# EAGLE design SmartRock_4-pin_EC_Breakout_v5 (EAGLE 9.7.0)
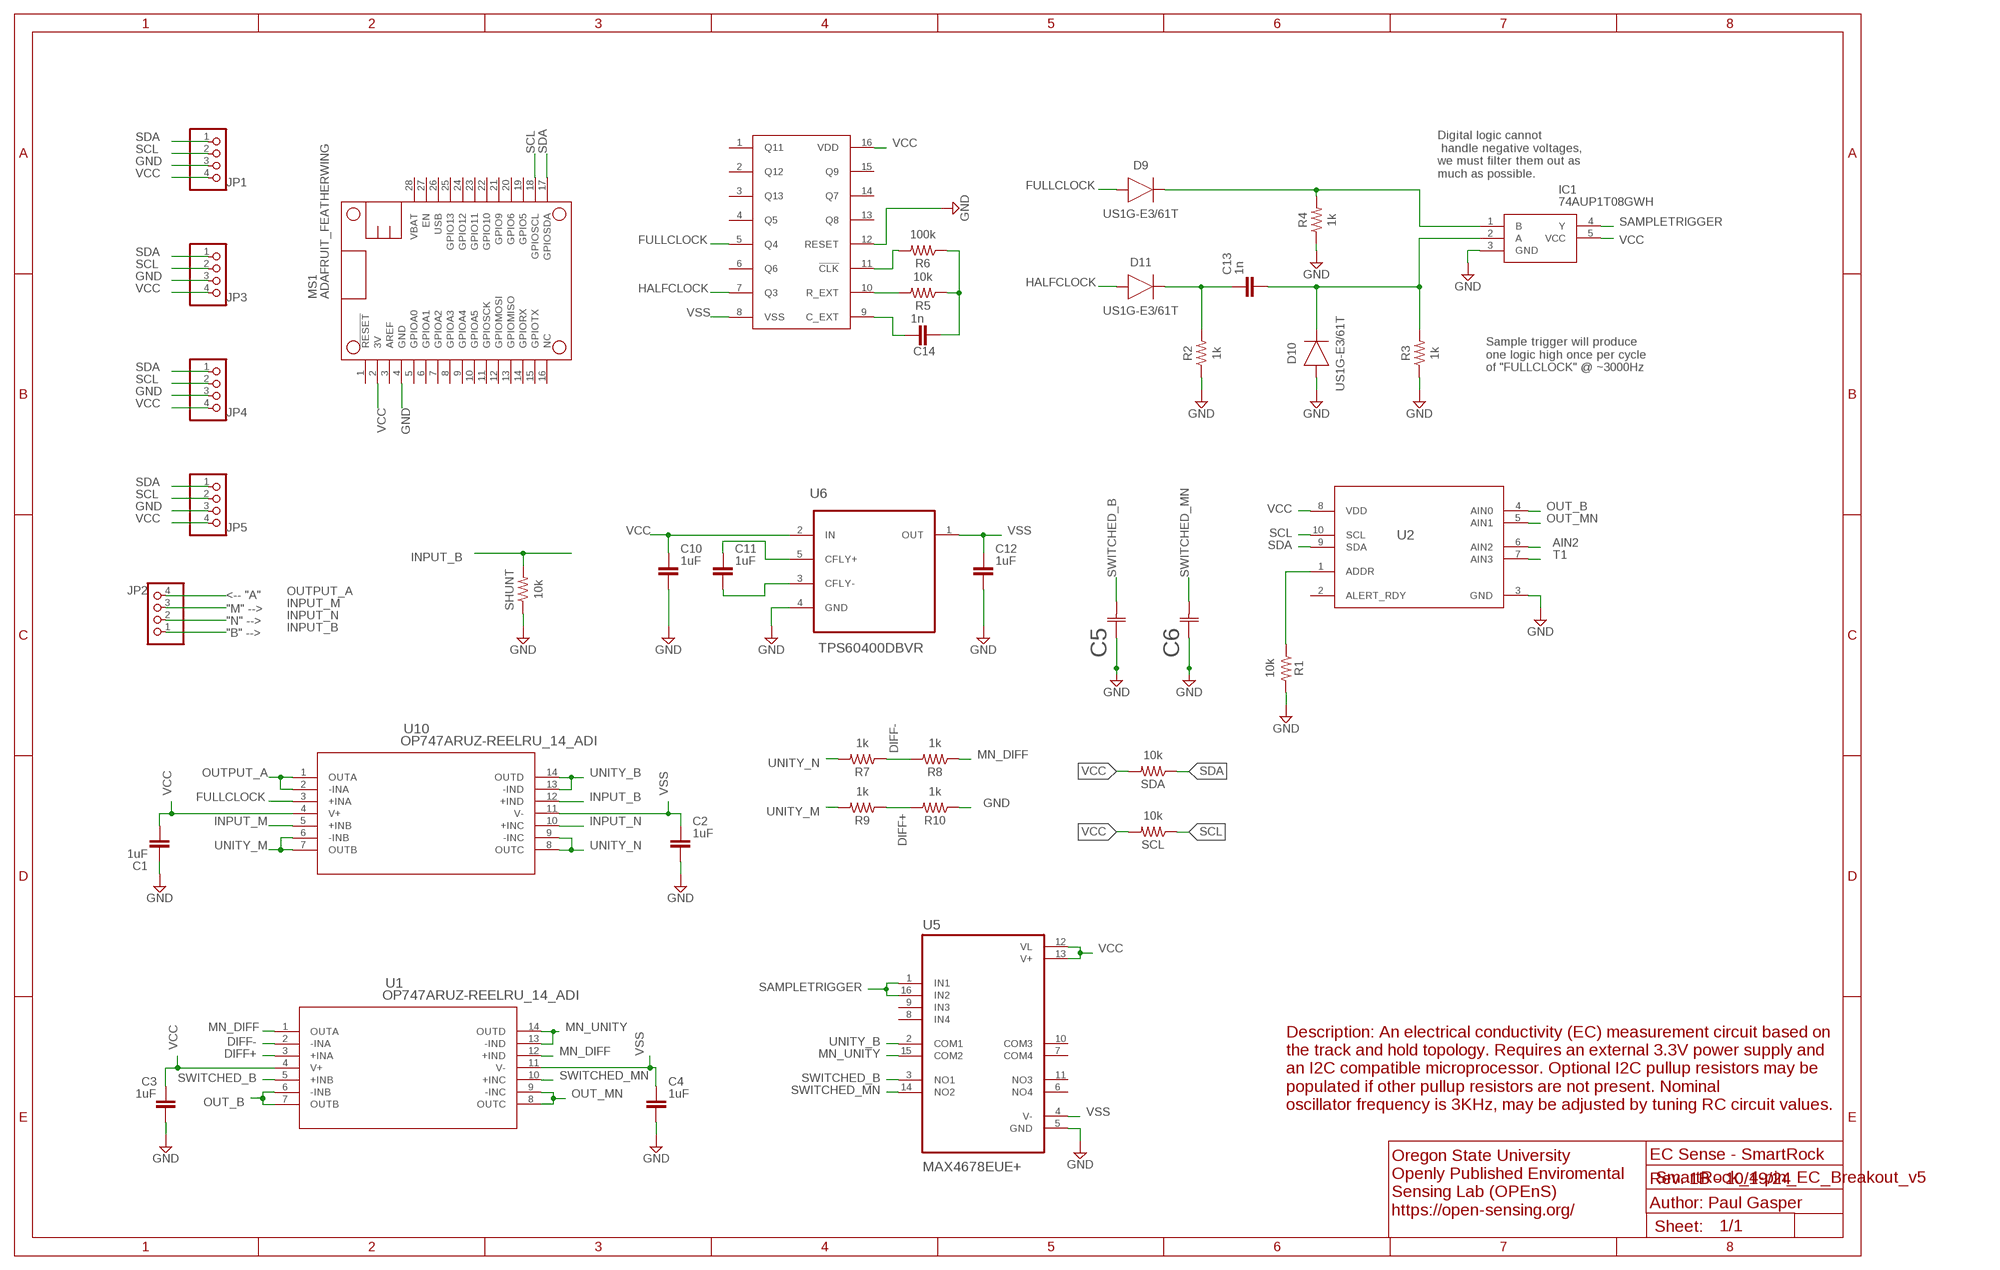
[diagram p0: schematic, sheet 1]

## Parts
C1  1uF  C_CHIP-0402(1005-METRIC)  [CAPC1005X60]
C2  1uF  C_CHIP-0402(1005-METRIC)  [CAPC1005X60]
C3  1uF  C_CHIP-0402(1005-METRIC)  [CAPC1005X60]
C4  1uF  C_CHIP-0402(1005-METRIC)  [CAPC1005X60]
C5  865090640004CAP_WCAP-ASLU_04P0X05P5_WRE-L  [CAP_WCAP-ASLU_04P0X05P5_WRE-L]
C6  865090640004CAP_WCAP-ASLU_04P0X05P5_WRE-L  [CAP_WCAP-ASLU_04P0X05P5_WRE-L]
C10  1uF  C_CHIP-0402(1005-METRIC)  [CAPC1005X60]
C11  1uF  C_CHIP-0402(1005-METRIC)  [CAPC1005X60]
C12  1uF  C_CHIP-0402(1005-METRIC)  [CAPC1005X60]
C13  1n  C_CHIP-0402(1005-METRIC)  [CAPC1005X60]
C14  1n  C_CHIP-0402(1005-METRIC)  [CAPC1005X60]
D9  US1G-E3/61T  DIODE_US1G-E3/61T_SMA  [DIOM5226X290N]
D10  US1G-E3/61T  DIODE_US1G-E3/61T_SMA  [DIOM5226X290N]
D11  US1G-E3/61T  DIODE_US1G-E3/61T_SMA  [DIOM5226X290N]
IC1  74AUP1T08GWH  [SOT65P212X110-5N]
JP1  PINHD-1X4  [1X04]
JP2  PINHD-1X4  [1X04]
JP3  PINHD-1X4  [1X04]
JP4  PINHD-1X4  [1X04]
JP5  PINHD-1X4  [1X04]
MS1  ADAFRUIT_FEATHERWING  [ADAFRUIT_FEATHERWING]
R1  10k  R-US_CHIP-0402(1005-METRIC)  [RESC1005X40]
R2  1k  R-US_CHIP-0402(1005-METRIC)  [RESC1005X40]
R3  1k  R-US_CHIP-0402(1005-METRIC)  [RESC1005X40]
R4  1k  R-US_CHIP-0402(1005-METRIC)  [RESC1005X40]
R5  10k  R-US_CHIP-0402(1005-METRIC)  [RESC1005X40]
R6  100k  R-US_CHIP-0402(1005-METRIC)  [RESC1005X40]
R7  1k  R-US_CHIP-0402(1005-METRIC)  [RESC1005X40]
R8  1k  R-US_CHIP-0402(1005-METRIC)  [RESC1005X40]
R9  1k  R-US_CHIP-0402(1005-METRIC)  [RESC1005X40]
R10  1k  R-US_CHIP-0402(1005-METRIC)  [RESC1005X40]
SCL  10k  R-US_CHIP-0402(1005-METRIC)  [RESC1005X40]
SDA  10k  R-US_CHIP-0402(1005-METRIC)  [RESC1005X40]
SHUNT  10k  R-US_CHIP-0402(1005-METRIC)  [RESC1005X40]
U1  OP747ARUZ-REELRU_14_ADI  [RU_14_ADI]
U2  ADS1115IDGSRDGS0010A_L  [DGS0010A_L]
U4  CD4060BPWR  [CD4060BPWR]
U5  MAX4678EUE+  [SOP65P640X110-16N]
U6  TPS60400DBVR  [SOT95P280X145-5N]
U10  OP747ARUZ-REELRU_14_ADI  [RU_14_ADI]

## Nets
AIN2: U2.6(AIN2)
DIFF+: R9.1 R10.2 U1.3(+INA)
DIFF-: R7.1 R8.2 U1.2(-INA)
FULLCLOCK: D9.2(A) U4.5(Q4) U10.3(+INA)
GND: C1.1 C2.2 C3.2 C4.2 C5.1 C6.1 C10.2 C12.2 D10.2(A) IC1.3(GND) JP1.3 JP3.3 JP4.3 JP5.3 MS1.4(GND) R1.2 R2.1 R3.1 R4.1 R10.1 SHUNT.1 U2.3(GND) U4.12(RESET) U5.5(GND) U6.4(GND)
HALFCLOCK: D11.2(A) U4.7(Q3)
INPUT_B: JP2.1 SHUNT.2 U10.12(+IND)
INPUT_M: JP2.3 U10.5(+INB)
INPUT_N: JP2.2 U10.10(+INC)
MN_DIFF: R8.1 U1.1(OUTA) U1.12(+IND)
MN_UNITY: U1.13(-IND) U1.14(OUTD) U5.15(COM2)
N$1: D9.1(C) IC1.1(B) R4.2
N$7: C13.1 D11.1(C) R2.2
N$8: C11.2 U6.3(CFLY-)
N$9: C11.1 U6.5(CFLY+)
N$11: C13.2 D10.1(C) IC1.2(A) R3.2
N$12: R6.2 U4.11(!CLK)
N$13: R5.2 U4.10(R_EXT)
N$14: C14.1 U4.9(C_EXT)
N$15: C14.2 R5.1 R6.1
N$19: R1.1 U2.1(ADDR)
OUT_B: U1.6(-INB) U1.7(OUTB) U2.4(AIN0)
OUT_MN: U1.8(OUTC) U1.9(-INC) U2.5(AIN1)
OUTPUT_A: JP2.4 U10.1(OUTA) U10.2(-INA)
SAMPLETRIGGER: IC1.4(Y) U5.1(IN1) U5.16(IN2)
SCL: JP1.2 JP3.2 JP4.2 JP5.2 MS1.18(GPIOSCL) SCL.1 U2.10(SCL)
SDA: JP1.1 JP3.1 JP4.1 JP5.1 MS1.17(GPIOSDA) SDA.1 U2.9(SDA)
SWITCHED_B: C5.2 U1.5(+INB) U5.3(NO1)
SWITCHED_MN: C6.2 U1.10(+INC) U5.14(NO2)
T1: U2.7(AIN3)
UNITY_B: U5.2(COM1) U10.13(-IND) U10.14(OUTD)
UNITY_M: R9.2 U10.6(-INB) U10.7(OUTB)
UNITY_N: R7.2 U10.8(OUTC) U10.9(-INC)
VCC: C1.2 C3.1 C10.1 IC1.5(VCC) JP1.4 JP3.4 JP4.4 JP5.4 MS1.2(3V) SCL.2 SDA.2 U1.4(V+) U2.8(VDD) U4.16(VDD) U5.12(VL) U5.13(V+) U6.2(IN) U10.4(V+)
VSS: C2.1 C4.1 C12.1 U1.11(V-) U4.8(VSS) U5.4(V-) U6.1(OUT) U10.11(V-)
Unconnected: MS1.1(!RESET) MS1.3(AREF) MS1.5(GPIOA0) MS1.6(GPIOA1) MS1.7(GPIOA2) MS1.8(GPIOA3) MS1.9(GPIOA4) MS1.10(GPIOA5) MS1.11(GPIOSCK) MS1.12(GPIOMOSI) MS1.13(GPIOMISO) MS1.14(GPIORX) MS1.15(GPIOTX) MS1.16(NC) MS1.19(GPIO5) MS1.20(GPIO6) MS1.21(GPIO9) MS1.22(GPIO10) MS1.23(GPIO11) MS1.24(GPIO12) MS1.25(GPIO13) MS1.26(USB) MS1.27(EN) MS1.28(VBAT) U2.2(ALERT_RDY) U4.1(Q11) U4.2(Q12) U4.3(Q13) U4.4(Q5) U4.6(Q6) U4.13(Q8) U4.14(Q7) U4.15(Q9) U5.6(NO4) U5.7(COM4) U5.8(IN4) U5.9(IN3) U5.10(COM3) U5.11(NO3)

## Notes on the sheet
- Digital logic cannot
   handle negative voltages, 
  we must filter them out as 
  much as possible.
- Sample trigger will produce
  one logic high once per cycle 
  of "FULLCLOCK" @ ~3000Hz
- <-- "A"
- "M" -->
- "N" -->
- "B" -->
- Description: An electrical conductivity (EC) measurement circuit based on
  the track and hold topology. Requires an external 3.3V power supply and
  an I2C compatible microprocessor. Optional I2C pullup resistors may be
  populated if other pullup resistors are not present. Nominal
  oscillator frequency is 3KHz, may be adjusted by tuning RC circuit values.
- EC Sense - SmartRock
- Rev. 1B - 10/19/24
- Author: Paul Gasper
- Oregon State University
  Openly Published Enviromental
  Sensing Lab (OPEnS)
  https://open-sensing.org/

## Library data of the parts
C1-C4 C10-C14 = Capacitor:C: Capacitor - Generic; CATEGORY: Capacitor
C5 C6 = 2024-05-05_15-18-44_Library:865090640004; COPYRIGHT: Copyright (C) 2024 Ultra Librarian. All rights reserved.; MANUFACTURER_PART_NUMBER: 865090640004; MFR_NAME: Wurth Electronics
D9-D11 = Diode:DIODE_: Diode Rectifier - Popular parts; CATEGORY: Diode; DESCRIPTION: DIODE GEN PURP 400V 1A DO214AC; MANUFACTURER: Vishay Semiconductor Diodes Division; SUB-CATEGORY: Rectifier
IC1 = 74AUP1T08GWH:74AUP1T08GWH: 74AUP1T08 - Low-power 2-input AND gate with voltage-level translator@en-us Source: Datasheet <https://assets.nexperia.com/documents/data-sheet/74AUP1T08.pdf>; ARROW_PART_NUMBER: 74AUP1T08GWH; ARROW_PRICE-STOCK: https://www.arrow.com/en/products/74aup1t08gwh/nexperia?region=nac; DESCRIPTION: 74AUP1T08 - Low-power 2-input AND gate with voltage-level translator@en-us; HEIGHT: 1.1mm; MANUFACTURER_NAME: Nexperia; MANUFACTURER_PART_NUMBER: 74AUP1T08GWH; MOUSER_PART_NUMBER: 771-74AUP1T08GWH; MOUSER_PRICE-STOCK: https://www.mouser.co.uk/ProductDetail/Nexperia/74AUP1T08GWH?qs=chTDxNqvsynKkpBm9IAgCA%3D%3D
JP1-JP5 = pinhead:PINHD-1X4: PIN HEADER
MS1 = Hypnos V3.3:ADAFRUIT_FEATHERWING
R1-R10 SCL SDA SHUNT = Resistor:R-US: Resistor Fixed - ANSI; CATEGORY: Resistor; SUB-CATEGORY: Fixed
U1 U10 = 2024-03-05_14-57-50_Library:OP747ARUZ-REEL; COPYRIGHT: Copyright (C) 2024 Ultra Librarian. All rights reserved.; MANUFACTURER_PART_NUMBER: OP747ARUZ-REEL; MFR_NAME: Analog Devices Inc
U2 = Library:ADS1115IDGSR; COPYRIGHT: Copyright (C) 2024 Ultra Librarian. All rights reserved.; MANUFACTURER_PART_NUMBER: ADS1115IDGSR; MFR_NAME: Texas Instruments; REFDES: RefDes; TYPE: TYPE
U4 = PNNL_Wenner:CD4060BPWR
U5 = MAX4678EUE_:MAX4678EUE+
U6 = TPS60400DBVR:TPS60400DBVR: Unregulated 60mA charge pump Voltage Inverter; AVAILABILITY: Unavailable; DESCRIPTION: 60mA Charge Pump Voltage Inverter with Variable Switching Frequency 5-SOT-23 -40 to 85; MF: Texas Instruments; MP: TPS60400DBVR; PACKAGE: SOT-23-5 Texas Instruments; PRICE: None

## Board
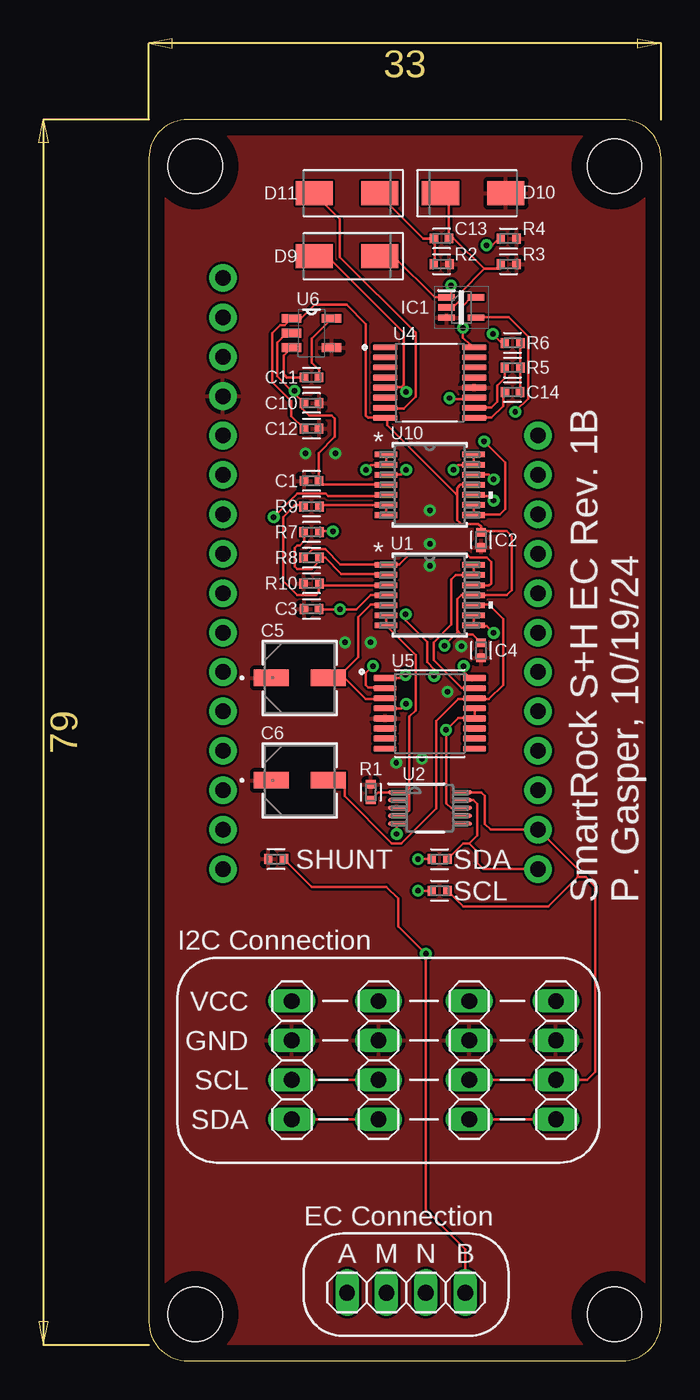
[diagram p1: board, top side]
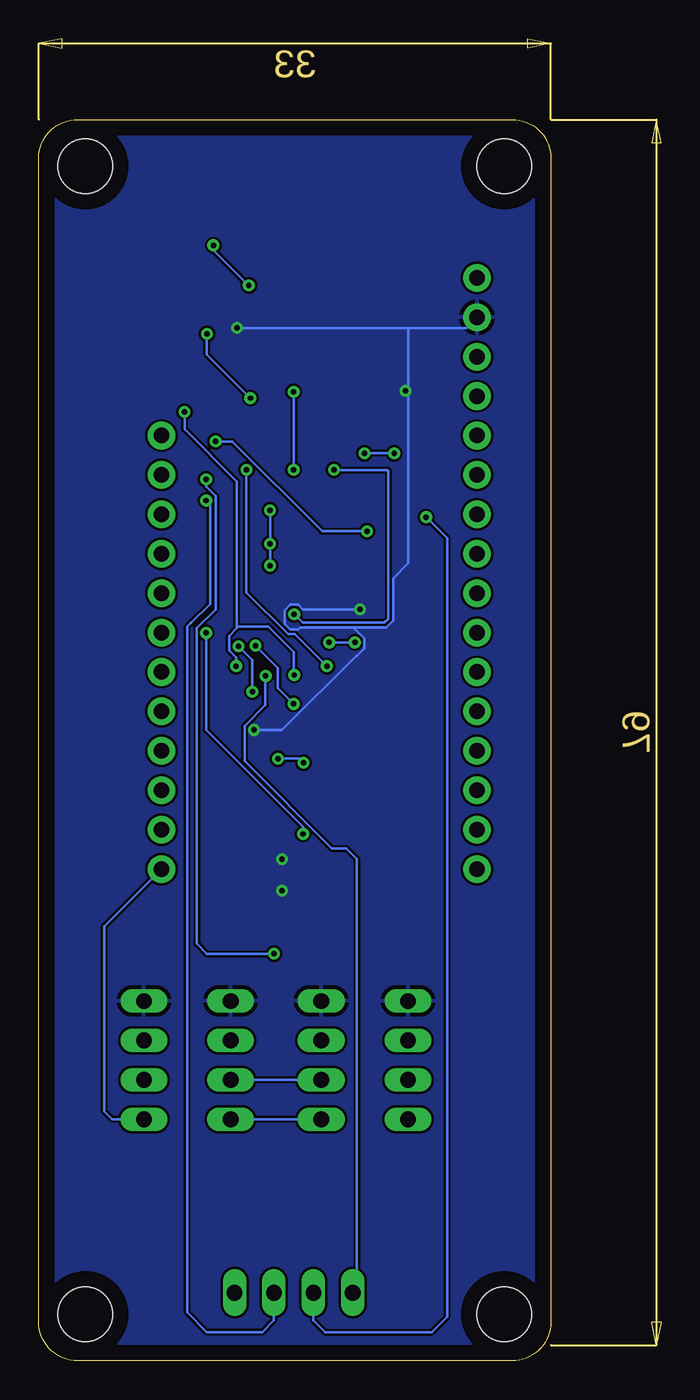
[diagram p2: board, bottom side, seen from below]

Size 33 x 80 mm. Coordinates in mm from the lower left corner, seen from the top.
Outline: 0,77.5 0,2.5 arc90 2.5,0 30.5,0 arc90 33,2.5 33,77.5 arc90 30.5,80 2.5,80 arc90 0,77.5
Copper layers (1*16): Top 0.035mm / dielectric 1.5mm / Bottom 0.035mm
Design rules "Fusion Electronics Design Rules": minimum track width 6mil, minimum drill 0.35mm, track to track 6mil, track to pad 6mil, pad to pad 6mil, via to via 6mil, smd to smd 6mil, copper to edge 40mil, drill to drill 6mil, minimum pad ring 10mil, minimum via ring 8mil, stop-mask expansion 4mil, vias tented up to drill 0mil, thermal gap 10mil
Holes 3.5 mm at 3,77 30,77 3,3 30,3

### Footprints (pad centres in the part's own frame; a part is rotated, then mirrored left to right if it is on the bottom)
CAPC1005X60 = smd 0.56 x 0.629: 1 -0.485,0; 2 0.485,0
CAP_WCAP-ASLU_04P0X05P5_WRE-L = smd 2.261 x 1.067: 1 -1.829,0; 2 1.829,0
DIOM5226X290N = smd 2.392 x 1.565: 1 -2.108,0; 2 2.108,0
SOT65P212X110-5N = smd 1.05 x 0.4: 1 -0.95,0.65; 2 -0.95,0; 3 -0.95,-0.65; 4 0.95,-0.65; 5 0.95,0.65
1X04 = drill 1.016 long: 1 -3.81,0; 2 -1.27,0; 3 1.27,0; 4 3.81,0
ADAFRUIT_FEATHERWING = drill 1 pad 1.778: 1 6.35,1.27; 2 8.89,1.27; 3 11.43,1.27; 4 13.97,1.27; 5 16.51,1.27; 6 19.05,1.27; 7 21.59,1.27; 8 24.13,1.27; 9 26.67,1.27; 10 29.21,1.27; 11 31.75,1.27; 12 34.29,1.27; 13 36.83,1.27; 14 39.37,1.27; 15 41.91,1.27; 16 44.45,1.27; 17 44.45,21.59; 18 41.91,21.59; 19 39.37,21.59; 20 36.83,21.59; 21 34.29,21.59; 22 31.75,21.59; 23 29.21,21.59; 24 26.67,21.59; 25 24.13,21.59; 26 21.59,21.59; 27 19.05,21.59; 28 16.51,21.59
RESC1005X40 = smd 0.535 x 0.644: 1 -0.507,0; 2 0.507,0
RU_14_ADI = smd 1.473 x 0.356: 1 -2.819,1.95; 2 -2.819,1.3; 3 -2.819,0.65; 4 -2.819,0; 5 -2.819,-0.65; 6 -2.819,-1.3; 7 -2.819,-1.95; 8 2.819,-1.95; 9 2.819,-1.3; 10 2.819,-0.65; 11 2.819,0; 12 2.819,0.65; 13 2.819,1.3; 14 2.819,1.95
DGS0010A_L = smd 1.15 x 0.25: 1 -2.125,1; 2 -2.125,0.5; 3 -2.125,0; 4 -2.125,-0.5; 5 -2.125,-1; 6 2.125,-1; 7 2.125,-0.5; 8 2.125,0; 9 2.125,0.5; 10 2.125,1
CD4060BPWR = smd 1.57 x 0.41: 1 -2.87,2.275; 2 -2.87,1.625; 3 -2.87,0.975; 4 -2.87,0.325; 5 -2.87,-0.325; 6 -2.87,-0.975; 7 -2.87,-1.625; 8 -2.87,-2.275; 9 2.87,-2.275; 10 2.87,-1.625; 11 2.87,-0.975; 12 2.87,-0.325; 13 2.87,0.325; 14 2.87,0.975; 15 2.87,1.625; 16 2.87,2.275
SOP65P640X110-16N = smd 1.5 x 0.41: 1 -2.885,2.275; 2 -2.885,1.625; 3 -2.885,0.975; 4 -2.885,0.325; 5 -2.885,-0.325; 6 -2.885,-0.975; 7 -2.885,-1.625; 8 -2.885,-2.275; 9 2.885,-2.275; 10 2.885,-1.625; 11 2.885,-0.975; 12 2.885,-0.325; 13 2.885,0.325; 14 2.885,0.975; 15 2.885,1.625; 16 2.885,2.275
SOT95P280X145-5N = smd 1.27 x 0.559: 1 -1.295,0.94; 2 -1.295,0; 3 -1.295,-0.94; 4 1.295,-0.94; 5 1.295,0.94

### Placement (x,y rotation side)
C1  10.48,56.71 0 top
C2  21.4,52.9 270 top
C3  10.48,48.45 180 top
C4  21.4,45.79 270 top
C5  9.72,44.01 0 top
C6  9.72,37.41 0 top
C10  10.48,61.73 0 top
C11  10.48,63.38 180 top
C12  10.48,60.08 0 top
C13  18.86,72.33 0 top
C14  23.43,62.42 0 top
D9  12.77,71.19 180 top
D10  20.89,75.25 0 top
D11  12.77,75.25 180 top
IC1  20.13,67.89 0 top
JP1  9.21,19.37 90 top
JP2  16.58,4.39 180 top
JP3  14.8,19.37 90 top
JP4  20.64,19.37 90 top
JP5  26.23,19.37 90 top
MS1  3.5,76.14 270 top
R1  14.29,36.64 90 top
R2  18.86,70.68 180 top
R3  23.18,70.68 180 top
R4  23.18,72.33 180 top
R5  23.43,64.01 180 top
R6  23.43,65.6 180 top
R7  10.48,53.41 0 top
R8  10.48,51.76 0 top
R9  10.48,55.06 0 top
R10  10.48,50.11 0 top
SCL  18.73,30.29 180 top
SDA  18.73,32.33 180 top
SHUNT  8.19,32.33 0 top
U1  18.1,49.34 0 top
U2  18.1,35.63 0 top
U4  18.1,63.04 0 top
U5  18.1,41.72 0 top
U6  10.48,66.23 0 top
U10  18.1,56.46 0 top

### Tracks (layer width: path | path; a pad name or v marks a point on that pad's centre or on a via)
DIFF+
  Top 0.152: R9.1 9.87,55.14 9.41,55.14 8.65,54.37 8.65,50.26 9.57,49.34 10.79,49.34 10.94,49.5 10.94,50.11 R10.2 11.14,49.95 15.2,49.95 U1.3
DIFF-
  Top 0.152: R7.1 10.02,53.31 10.02,52.85 9.72,52.54 9.57,52.54 9.39,52.37 9.39,51.2 9.57,51.02 10.48,51.02 11.09,51.63 R8.2 11.37,51.76 12.41,50.72 15.2,50.72 U1.2
FULLCLOCK  (via drill 0.35)
  Top 0.152: v16.58,57.42 16.27,57.12 15.36,57.12 U10.3 | 16.27,62.75 v16.58,62.45 | 16.27,62.75 15.36,62.75 U4.5 | 16.27,62.75 16.42,62.91 16.42,66.26 11.81,70.87 11.55,71.14 11.5,71.19 D9.2
  Bottom 0.152: v16.58,62.45 v16.58,57.42
GND  (via drill 0.35)
  Bottom 0.152: v18.1,51.25 v18.1,52.65 v18.1,54.81 | v17.59,38.8 16.2,38.8 v15.94,38.55 | v12.64,46.3 v14.29,46.3 | v19.24,43.12 19.24,45.15 v20.13,46.04 | v10.1,58.49 v12,58.49 v12.01,58.48
  pour Top: 0.02,-0.11 33.39,-0.11 33.39,80.26 0.02,80.26
HALFCLOCK
  Top 0.152: U4.7 15.36,61.38 16.42,61.38 17.19,62.15 17.19,66.26 12.31,71.14 12.31,73.58 10.63,75.25 D11.2
INPUT_B  (via drill 0.35)
  Top 0.152: v22.22,56.81 21.91,57.12 21,57.12 U10.12 | SHUNT.2 10.48,30.55 15.31,30.55 16.07,29.79 16.07,28.01 v17.85,26.23 17.85,9.72 20.39,7.18 JP2.1
  Bottom 0.152: v22.22,56.81 22.22,56.35 21.6,55.75 21.6,48.43 22.82,47.21 22.82,26.89 22.16,26.23 v17.85,26.23
INPUT_M  (via drill 0.35)
  Top 0.152: v8.04,54.37 9.57,55.9 11.39,55.9 11.55,55.75 15.2,55.75 U10.5
  Bottom 0.152: JP2.3 15.31,2.61 14.54,1.85 7.69,1.85 6.7,2.84 6.7,53.03 v8.04,54.37
INPUT_N  (via drill 0.35)
  Top 0.152: v22.22,55.44 21.91,55.75 21,55.75 U10.10
  Bottom 0.152: v22.22,55.44 21.96,55.19 21.96,48.78 23.18,47.57 23.23,47.52 23.43,47.31 23.43,3.12 22.16,1.85 18.61,1.85 17.85,2.61 JP2.2
MN_DIFF
  Top 0.152: R8.1 10.02,51.78 10.55,52.31 11.35,52.31 12.33,51.33 15.2,51.33 U1.1 15.36,51.33 16.12,51.33 16.73,51.94 20.54,51.94 20.69,51.78 21.76,51.78 22.06,51.48 22.06,50.11 21.91,49.95 21,49.95 U1.12
MN_UNITY
  Top 0.152: U1.14 U1.13 19.78,50.64 19.5,50.36 19.5,47.44 18.35,46.3 18.35,45.15 20.16,43.35 U5.15
N$1  (via drill 0.35)
  Top 0.152: R4.2 22.62,72.38 22.65,72.41 22.14,71.9 v21.76,71.9 | v19.47,69.31 19.47,68.55 19.32,68.39 IC1.1 19.17,68.55 18.41,68.55 15.81,71.14 14.9,71.14 D9.1
  Bottom 0.152: v21.76,71.9 21.76,71.59 v19.47,69.31
N$7
  Top 0.152: R2.2 18.41,70.7 18.41,72.58 C13.1 17.67,72.33 14.75,75.25 D11.1
N$8
  Top 0.152: C11.2 8.89,63.38 8.68,63.59 8.68,64.79 U6.3
N$9
  Top 0.152: C11.1 10.96,63.84 10.48,64.33 10.48,65.88 U6.5
N$11
  Top 0.152: 21.6,70.38 22.65,70.38 R3.2 | 21.6,70.38 19.62,72.36 19.35,72.36 | 19.35,72.36 19.32,72.36 19.32,74.95 19.01,75.25 D10.1 | 19.35,72.36 C13.2 | 21.6,70.38 20.08,68.85 20.08,68.39 19.6,67.91 19.39,67.91 IC1.2
N$12  (via drill 0.35)
  Top 0.152: v22.16,66.18 22.16,66.16 22.94,65.39 R6.2 | v19.37,62.04 19.42,61.99 20.84,61.99 U4.11
  Bottom 0.152: v22.16,66.18 22.16,64.84 v19.37,62.04
N$13
  Top 0.152: U4.10 22.05,61.42 22.44,61.81 22.44,62.83 22.93,63.32 R5.2
N$14
  Top 0.152: C14.1 22.82,62.31 22.82,61.54 22.06,60.77 21,60.77 U4.9
N$15
  Top 0.152: R6.1 R5.1 23.92,63.99 C14.2
N$19
  Top 0.152: R1.1 14.78,36.63 U2.1
OUT_B
  Top 0.152: U1.6 U1.7 17.18,45.49 17.18,41.92 16.78,41.52 16.78,35.48 16.42,35.13 U2.4
OUT_MN  (via drill 0.35)
  Top 0.152: U1.9 U1.8 21,47.36 21.76,47.36 v22.22,46.91 | v15.97,33.95 15.97,34.56 U2.5
  Bottom 0.152: v15.97,33.95 15.97,34.41 22.22,40.66 v22.22,46.91
OUTPUT_A  (via drill 0.35)
  Top 0.152: U10.1 U10.2 15.2,57.73 14.29,57.73 v13.98,57.42 | v16.55,48.12 16.55,47.7 17.92,46.32 17.92,45.03 18.38,44.57 v18.38,44.14
  Bottom 0.152: v18.38,44.14 18.41,44.12 18.41,42.25 19.74,40.91 19.74,38.64 14.11,33.01 13.2,33.01 12.51,32.33 12.51,4.64 JP2.4 | v13.98,57.42 10.56,57.42 10.48,57.34 10.48,47.82 10.73,47.57 16,47.57 v16.55,48.12
SAMPLETRIGGER  (via drill 0.35)
  Top 0.152: IC1.4 21.12,67.28 23.18,67.28 24.44,66.02 24.44,62.03 23.61,61.2 v23.61,61.16 | v20.28,44.77 20.28,44.42 20.84,43.86 U5.16 | U5.1 15.36,44.01 16.35,44.01 v16.54,44.2
  Bottom 0.152: 20.23,47.34 18.23,47.34 16.58,45.69 16.58,44.23 v16.54,44.2 | 20.23,47.34 20.23,47.21 20.74,46.7 20.74,45.79 20.28,45.34 v20.28,44.77 | 20.23,47.34 20.23,56.66 23.61,60.03 v23.61,61.16
SCL
  Top 0.152: JP1.2 JP3.2 | SCL.1 20.26,29.28 25.72,29.28 27.62,31.18 | 27.62,31.18 27.62,31.69 MS1.18 22.04,34.23 21.66,34.61 21.66,36.39 21.42,36.63 U2.10 | 27.62,31.18 28.13,31.18 28.77,30.55 28.77,18.61 28.26,18.1 JP5.2 JP4.2
  Bottom 0.152: JP3.2 JP4.2
SDA
  Top 0.152: JP1.1 JP3.1 | JP4.1 JP5.1 | U2.9 20.9,36.13 21.15,35.88 21.15,33.85 20.64,33.34 | MS1.17 21.53,31.69 21.15,32.07 21.15,32.83 20.64,33.34 | SDA.1 20.26,33.34 20.64,33.34
  Bottom 0.152: JP5.1 28.26,15.56 28.77,16.07 28.77,28.01 MS1.17 | JP3.1 JP4.1
SWITCHED_B
  Top 0.152: 12.31,44.16 11.85,43.7 C5.2 12.63,44.49 | 12.31,44.16 12.63,44.49 | 12.63,44.49 13.5,45.36 13.5,47.95 14.29,48.73 15.2,48.73 U1.5 | 12.31,44.16 12.46,44.16 13.98,42.64 15.2,42.64 U5.3
SWITCHED_MN
  Top 0.152: U1.10 21,48.73 21.91,48.73 22.82,47.82 22.82,43.55 21.91,42.64 21,42.64 U5.14 20.84,42.64 19.93,42.64 18.53,41.24 18.53,35.6 16.27,33.34 15.66,33.34 12.61,36.39 12.61,37.39 C6.2
UNITY_B  (via drill 0.35)
  Top 0.152: U10.14 U10.13 20.84,57.73 19.93,57.73 v19.62,57.42 | v14.44,44.77 13.98,44.31 13.98,43.55 14.14,43.4 15.2,43.4 U5.2
  Bottom 0.152: v14.44,44.77 16.49,46.82 16.92,46.82 19.62,49.52 v19.62,57.42
UNITY_M
  Top 0.152: U10.7 U10.6 15.2,55.14 11.09,55.14 R9.2
UNITY_N  (via drill 0.35)
  Top 0.152: U10.9 U10.8 21,54.53 22.6,54.53 22.95,54.88 22.95,57.9 v21.6,59.25 | v11.85,53.46 11.09,53.46 R7.2
  Bottom 0.152: v11.85,53.46 14.75,53.46 20.54,59.25 v21.6,59.25
VCC  (via drill 0.35)
  Top 0.152: U5.13 U5.12 20.84,41.42 19.93,41.42 19.17,40.66 | U10.4 11.22,56.46 C1.2 10.94,56.81 10.94,58.51 11.98,59.56 11.98,60.72 11.77,60.93 10.33,60.93 9.87,61.38 9.87,61.69 C10.1 9.32,62.41 | 9.32,62.41 8.26,63.46 8.26,65.61 8.89,66.23 U6.2 | U2.8 19.47,35.63 19.17,35.93 19.17,40.66 | U1.4 14.29,49.34 13.38,48.43 v12.31,48.43 11.09,48.43 C3.1 | U4.16 20.84,65.19 20.69,65.35 20.69,65.5 20.23,65.96 v20.23,66.56 20.23,67.99 20.78,68.54 IC1.5 | 19.17,40.66 v19.14,40.66 | v9.38,62.52 9.32,62.46 9.32,62.41 | v17.34,32.33 SDA.2 | v17.34,30.29 SCL.2
  Bottom 0.152: 9.18,66.56 v20.23,66.56 | MS1.2 5.45,66.56 9.18,66.56 | 9.18,66.56 9.18,62.32 | 9.18,62.32 9.18,51.4 10.18,50.41 10.18,47.69 10.61,47.26 12.75,47.26 | v19.14,40.66 17.34,40.66 12.56,45.44 12.52,45.44 12.03,45.92 12.03,46.55 12.75,47.26 | 12.75,47.26 16.16,47.26 16.3,47.13 16.8,47.13 17.16,47.48 17.16,48.37 16.8,48.72 16.3,48.72 16,48.43 v12.31,48.43 | v9.38,62.52 9.18,62.32
  pour Bottom: 0.02,-0.11 33.39,-0.11 33.39,80.26 0.02,80.26
VSS  (via drill 0.35)
  Top 0.152: C12.1 9.18,60.89 9.18,61.85 7.95,63.08 7.95,66.24 8.45,66.74 8.75,66.74 U6.1 9.79,67.17 10.68,68.06 12.74,68.06 13.98,66.82 13.98,60.93 14.14,60.77 15.2,60.77 U4.8 15.36,60.62 15.36,60.32 19.8,55.87 19.88,55.87 | C4.1 20.87,46.8 20.13,46.8 19.94,47 | 19.88,55.87 19.88,54.17 20.03,54.02 20.13,53.92 21.24,53.92 21.4,53.75 C2.1 21.45,53.46 23.05,53.46 23.38,53.13 23.38,49.67 23.05,49.34 U1.11 20.13,49.34 19.88,49.09 19.88,47.06 19.94,47 | 19.88,55.87 19.88,56.26 20.08,56.46 U10.11 | v16.58,42.33 16.27,42.03 15.36,42.03 U5.4 | 19.94,47 v19.04,46.09
  Bottom 0.152: v16.58,42.33 17.59,43.35 17.59,44.64 v19.04,46.09

### Text on the board
tPlace: U10 | U1 | U2 | VCC | GND | SCL | SDA | A | M | N | B
tNames: SmartRock S+H EC Rev. 1B / P. Gasper, 10/19/24 | I2C Connection | EC Connection